# Altium schematic sheet CoverSheet.SchDoc
size A4; SheetNumber: 1; SheetTotal: 8
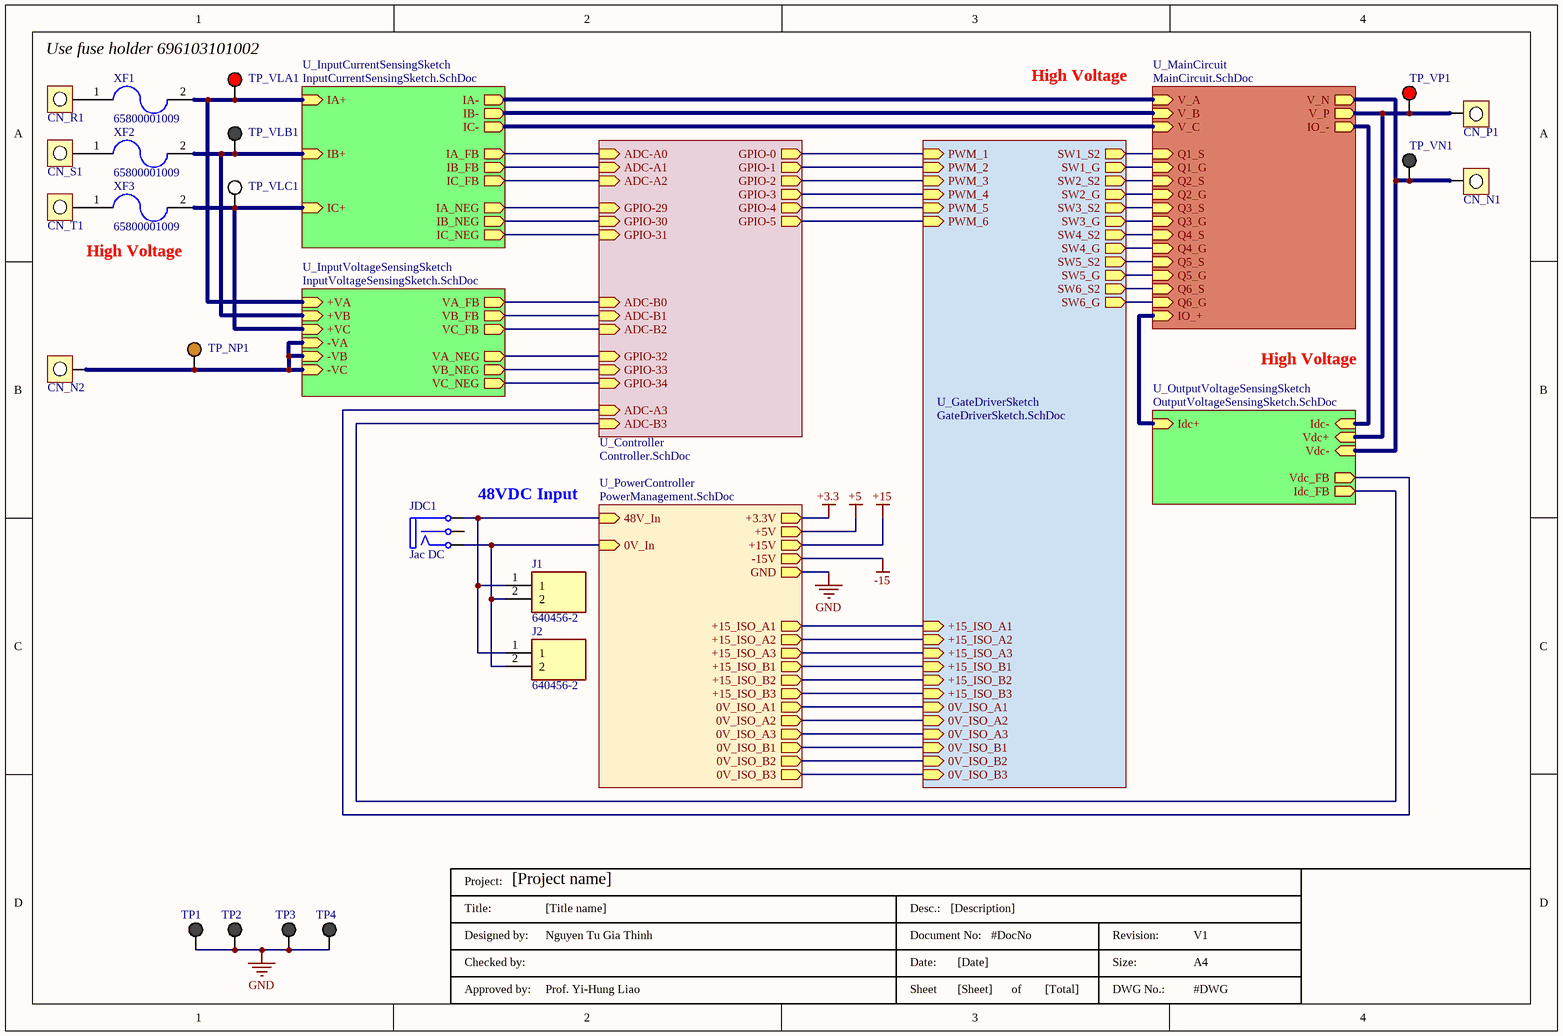
[diagram p0: CoverSheet.SchDoc]

## Parts
CN_N1  CN  [P-820W]  (value not drawn)
CN_N2  CN  [P-820W]  (value not drawn)
CN_P1  CN  [P-820W]  (value not drawn)
CN_R1  CN  [P-820W]  (value not drawn)
CN_S1  CN  [P-820W]  (value not drawn)
CN_T1  CN  [P-820W]  (value not drawn)
J1  640456-2  [SHDR2W66P0X254_1X2_508X572X1041P]
J2  640456-2  [SHDR2W66P0X254_1X2_508X572X1041P]
JDC1  Jac DC  [DC-IN]
TitleBlock  DWG No.: #DWG  Size:: A4  Revision:: V1  Total of Sheets: [Total]  Sheet: [Sheet]  Date:: [Date]  Document No:: #DocNo  Desc.:: [Description]  Approved by:: Prof. Yi-Hung Liao  Designed by:: Nguyen Tu Gia Thinh  Title:: [Title name]  Project: [Project name]  (hidden comment: TitleBlock)  (graphical)
TP1  (no value)  [5001]
TP2  (no value)  [5001]
TP3  (no value)  [5001]
TP4  (no value)  [5001]
TP_NP1  (no value)  [5003]
TP_VLA1  (no value)  [5000]
TP_VLB1  (no value)  [5001]
TP_VLC1  (no value)  [5002]
TP_VN1  (no value)  [5001]
TP_VP1  (no value)  [5000]
XF1  65800001009  [FUSM250108X1320N]
XF2  65800001009  [FUSM250108X1320N]
XF3  65800001009  [FUSM250108X1320N]

## Sub-sheets
U_Controller = Controller.SchDoc: ADC-A0 (in), ADC-A1 (in), ADC-A2 (in), ADC-A3 (in), GPIO-0 (out), GPIO-1 (out), GPIO-2 (out), GPIO-3 (out), GPIO-4 (out), GPIO-5 (out), ADC-B0 (in), ADC-B1 (in), ADC-B2 (in), ADC-B3 (in), GPIO-29 (in), GPIO-30 (in), GPIO-31 (in), GPIO-32 (in), GPIO-33 (in), GPIO-34 (in)
U_GateDriverSketch = GateDriverSketch.SchDoc: SW1_G (out), SW2_G (out), SW1_S2 (out), SW2_S2 (out), PWM_1 (in), PWM_2 (in), SW3_G (out), SW4_G (out), SW3_S2 (out), SW4_S2 (out), PWM_3 (in), PWM_4 (in), SW5_G (out), SW6_G (out), SW5_S2 (out), SW6_S2 (out), PWM_5 (in), PWM_6 (in), 0V_ISO_A1 (in), +15_ISO_A1 (in), +15_ISO_B1 (in), +15_ISO_A2 (in), +15_ISO_B2 (in), +15_ISO_A3 (in), +15_ISO_B3 (in), 0V_ISO_B1 (in), 0V_ISO_A2 (in), 0V_ISO_B2 (in), 0V_ISO_A3 (in), 0V_ISO_B3 (in)
U_InputCurrentSensingSketch = InputCurrentSensingSketch.SchDoc: IA- (out), IB- (out), IC- (out), IA+ (in), IB+ (in), IA_FB (out), IB_FB (out), IC_FB (out), IC+ (in), IA_NEG (out), IB_NEG (out), IC_NEG (out)
U_InputVoltageSensingSketch = InputVoltageSensingSketch.SchDoc: +VA (in), -VA (in), +VB (in), -VB (in), +VC (in), -VC (in), VA_FB (out), VB_FB (out), VC_FB (out), VA_NEG (out), VB_NEG (out), VC_NEG (out)
U_MainCircuit = MainCircuit.SchDoc: V_A (in), V_B (in), V_C (in), V_N (out), V_P (out), IO_- (out), IO_+ (in), Q1_G (in), Q2_G (in), Q3_G (in), Q6_G (in), Q5_G (in), Q4_G (in), Q1_S (in), Q2_S (in), Q3_S (in), Q6_S (in), Q5_S (in), Q4_S (in)
U_OutputVoltageSensingSketch = OutputVoltageSensingSketch.SchDoc: Vdc+ (in), Vdc- (in), Idc+ (in), Idc- (in), Vdc_FB (out), Idc_FB (out)
U_PowerController = PowerManagement.SchDoc: +15V (out), -15V (out), +3.3V (out), 48V_In (in), 0V_In (in), +5V (out), GND (out), +15_ISO_A1 (out), 0V_ISO_A1 (out), 0V_ISO_B1 (out), 0V_ISO_A2 (out), 0V_ISO_B2 (out), 0V_ISO_B3 (out), 0V_ISO_A3 (out), +15_ISO_A2 (out), +15_ISO_A3 (out), +15_ISO_B3 (out), +15_ISO_B2 (out), +15_ISO_B1 (out)

## Nets
+3.3: sheet U_PowerController/+3.3V
+5: sheet U_PowerController/+5V
+15: sheet U_PowerController/+15V
-15: sheet U_PowerController/-15V
GND: TP1.1 TP2.1 TP3.1 TP4.1 ; sheet U_PowerController/GND
NetCN_N1_1: CN_N1.1 TP_VN1.1 ; sheet U_OutputVoltageSensingSketch/Vdc-, sheet U_MainCircuit/V_N
NetCN_N2_1: CN_N2.1 TP_NP1.1 ; sheet U_InputVoltageSensingSketch/-VA, sheet U_InputVoltageSensingSketch/-VB, sheet U_InputVoltageSensingSketch/-VC
NetCN_P1_1: CN_P1.1 TP_VP1.1 ; sheet U_OutputVoltageSensingSketch/Vdc+, sheet U_MainCircuit/V_P
NetCN_R1_1: CN_R1.1 XF1.1
NetCN_S1_1: CN_S1.1 XF2.1
NetCN_T1_1: CN_T1.1 XF3.1
NetJ1_1: J1.1 J2.1 JDC1.1(T) ; sheet U_PowerController/48V_In
NetJ1_2: J1.2 J2.2 JDC1.2(TN) ; sheet U_PowerController/0V_In
NetTP_VLA1_1: TP_VLA1.1 XF1.2 ; sheet U_InputVoltageSensingSketch/+VA, sheet U_InputCurrentSensingSketch/IA+
NetTP_VLB1_1: TP_VLB1.1 XF2.2 ; sheet U_InputVoltageSensingSketch/+VB, sheet U_InputCurrentSensingSketch/IB+
NetTP_VLC1_1: TP_VLC1.1 XF3.2 ; sheet U_InputVoltageSensingSketch/+VC, sheet U_InputCurrentSensingSketch/IC+
(unnamed): sheet U_PowerController/+15_ISO_A1, sheet U_GateDriverSketch/+15_ISO_A1
(unnamed): sheet U_PowerController/0V_ISO_A1, sheet U_GateDriverSketch/0V_ISO_A1
(unnamed): sheet U_PowerController/0V_ISO_B1, sheet U_GateDriverSketch/0V_ISO_B1
(unnamed): sheet U_PowerController/0V_ISO_A2, sheet U_GateDriverSketch/0V_ISO_A2
(unnamed): sheet U_PowerController/0V_ISO_B2, sheet U_GateDriverSketch/0V_ISO_B2
(unnamed): sheet U_PowerController/0V_ISO_B3, sheet U_GateDriverSketch/0V_ISO_B3
(unnamed): sheet U_PowerController/0V_ISO_A3, sheet U_GateDriverSketch/0V_ISO_A3
(unnamed): sheet U_PowerController/+15_ISO_A2, sheet U_GateDriverSketch/+15_ISO_A2
(unnamed): sheet U_PowerController/+15_ISO_A3, sheet U_GateDriverSketch/+15_ISO_A3
(unnamed): sheet U_PowerController/+15_ISO_B3, sheet U_GateDriverSketch/+15_ISO_B3
(unnamed): sheet U_PowerController/+15_ISO_B2, sheet U_GateDriverSketch/+15_ISO_B2
(unnamed): sheet U_PowerController/+15_ISO_B1, sheet U_GateDriverSketch/+15_ISO_B1
(unnamed): sheet U_InputVoltageSensingSketch/VA_FB, sheet U_Controller/ADC-B0
(unnamed): sheet U_InputVoltageSensingSketch/VB_FB, sheet U_Controller/ADC-B1
(unnamed): sheet U_InputVoltageSensingSketch/VC_FB, sheet U_Controller/ADC-B2
(unnamed): sheet U_InputVoltageSensingSketch/VA_NEG, sheet U_Controller/GPIO-32
(unnamed): sheet U_InputVoltageSensingSketch/VB_NEG, sheet U_Controller/GPIO-33
(unnamed): sheet U_InputVoltageSensingSketch/VC_NEG, sheet U_Controller/GPIO-34
(unnamed): sheet U_InputCurrentSensingSketch/IA-, sheet U_MainCircuit/V_A
(unnamed): sheet U_InputCurrentSensingSketch/IB-, sheet U_MainCircuit/V_B
(unnamed): sheet U_InputCurrentSensingSketch/IC-, sheet U_MainCircuit/V_C
(unnamed): sheet U_InputCurrentSensingSketch/IA_FB, sheet U_Controller/ADC-A0
(unnamed): sheet U_InputCurrentSensingSketch/IB_FB, sheet U_Controller/ADC-A1
(unnamed): sheet U_InputCurrentSensingSketch/IC_FB, sheet U_Controller/ADC-A2
(unnamed): sheet U_InputCurrentSensingSketch/IA_NEG, sheet U_Controller/GPIO-29
(unnamed): sheet U_InputCurrentSensingSketch/IB_NEG, sheet U_Controller/GPIO-30
(unnamed): sheet U_InputCurrentSensingSketch/IC_NEG, sheet U_Controller/GPIO-31
(unnamed): sheet U_OutputVoltageSensingSketch/Idc+, sheet U_MainCircuit/IO_+
(unnamed): sheet U_OutputVoltageSensingSketch/Idc-, sheet U_MainCircuit/IO_-
(unnamed): sheet U_OutputVoltageSensingSketch/Vdc_FB, sheet U_Controller/ADC-A3
(unnamed): sheet U_OutputVoltageSensingSketch/Idc_FB, sheet U_Controller/ADC-B3
(unnamed): sheet U_GateDriverSketch/SW1_G, sheet U_MainCircuit/Q1_G
(unnamed): sheet U_GateDriverSketch/SW2_G, sheet U_MainCircuit/Q2_G
(unnamed): sheet U_GateDriverSketch/SW1_S2, sheet U_MainCircuit/Q1_S
(unnamed): sheet U_GateDriverSketch/SW2_S2, sheet U_MainCircuit/Q2_S
(unnamed): sheet U_GateDriverSketch/PWM_1, sheet U_Controller/GPIO-0
(unnamed): sheet U_GateDriverSketch/PWM_2, sheet U_Controller/GPIO-1
(unnamed): sheet U_GateDriverSketch/SW3_G, sheet U_MainCircuit/Q3_G
(unnamed): sheet U_GateDriverSketch/SW4_G, sheet U_MainCircuit/Q4_G
(unnamed): sheet U_GateDriverSketch/SW3_S2, sheet U_MainCircuit/Q3_S
(unnamed): sheet U_GateDriverSketch/SW4_S2, sheet U_MainCircuit/Q4_S
(unnamed): sheet U_GateDriverSketch/PWM_3, sheet U_Controller/GPIO-2
(unnamed): sheet U_GateDriverSketch/PWM_4, sheet U_Controller/GPIO-3
(unnamed): sheet U_GateDriverSketch/SW5_G, sheet U_MainCircuit/Q5_G
(unnamed): sheet U_GateDriverSketch/SW6_G, sheet U_MainCircuit/Q6_G
(unnamed): sheet U_GateDriverSketch/SW5_S2, sheet U_MainCircuit/Q5_S
(unnamed): sheet U_GateDriverSketch/SW6_S2, sheet U_MainCircuit/Q6_S
(unnamed): sheet U_GateDriverSketch/PWM_5, sheet U_Controller/GPIO-4
(unnamed): sheet U_GateDriverSketch/PWM_6, sheet U_Controller/GPIO-5

Not connected (* = marked no-connect by the designer): JDC1 3(S)

## Notes on the sheet
- Use fuse holder 696103101002
- High Voltage
- (near JDC1) 48VDC Input
- (in symbol Title Block 2) Project:; Title:; Desc.:; Designed by:; Document No:; Revision:; Checked by:; Date:; Size:; Approved by:; Sheet; of; DWG No.:

## Library data of the parts
CN_N1 CN_N2 CN_P1 CN_R1 CN_S1 CN_T1 = CN: Terminal
J1 J2 = 640456-2: Connector; Manufacturer_Name: TE Connectivity; Datasheet Link: http://www.te.com/commerce/DocumentDelivery/DDEController?Action=showdoc&DocId=Customer+Drawing%7F640456%7FW3%7Fpdf%7FEnglish%7FENG_CD_640456_W3.pdf%7F640456-2; Height: 10.414mm; Manufacturer_Part_Number: 640456-2; Mouser Part Number: 571-6404562; Mouser Price/Stock: https://www.mouser.co.uk/ProductDetail/TE-Connectivity-AMP/640456-2?qs=%2F35zJ5USjomRu3EJQJgZCQ%3D%3D; Arrow Part Number: 640456-2; Arrow Price/Stock: https://www.arrow.com/en/products/640456-2/te-connectivity?utm_currency=USD&region=europe
JDC1 = DCIN: Jac DC input; Value: Jac DC
TitleBlock = Title Block 2
TP1-TP4 TP_VLB1 TP_VN1 = 5001: Test Point Black, Multipurpose, TH
TP_NP1 = 5003: Test Point Orrange, Multipurpose, TH
TP_VLA1 TP_VP1 = 5000: Test Point Red, Multipurpose, TH
TP_VLC1 = 5002: Test Point White, Multipurpose, TH
XF1-XF3 = 65800001009: Hardware; Manufacturer_Name: LITTELFUSE; Datasheet Link: https://www.littelfuse.com/media?resourcetype=datasheets&itemid=7143dbe7-66cc-46d0-a668-04c7d18969fc&filename=littelfuse-fuse-block-656-datasheet; Height: 13.2mm; Manufacturer_Part_Number: 65800001009; Mouser Part Number: 576-65800001009; Mouser Price/Stock: https://www.mouser.co.uk/ProductDetail/Littelfuse/65800001009?qs=sU0fTKI0LumNKe7EsrMdwQ%3D%3D; Arrow Part Number: 65800001009; Arrow Price/Stock: https://www.arrow.com/en/products/65800001009/littelfuse?utm_currency=USD&region=nac